# Altium schematic sheet driver be main.SchDoc
size A
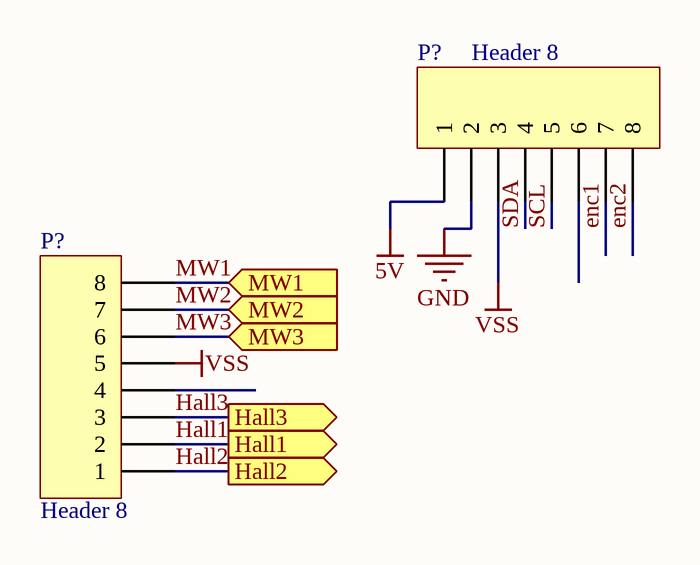
[diagram p0: driver be main.SchDoc]

## Parts
(Parts that share a designator on the sheet are numbered #1, #2 ... from top to bottom, then left to right.)
P?#1  Header 8  [HDR1X8]
P?#2  Header 8  [HDR1X8]

## Ports
Hall1 (out), Hall2 (out), Hall3 (out), MW1 (in), MW2 (in), MW3 (in)

## Nets
5V: P?#1.1
GND: P?#1.2
VSS: P?#1.3 P?#2.5
enc1: P?#1.7
enc2: P?#1.8
Hall1: P?#2.2 ; port Hall1
Hall2: P?#2.1 ; port Hall2
Hall3: P?#2.3 ; port Hall3
MW1: P?#2.8 ; port MW1
MW2: P?#2.7 ; port MW2
MW3: P?#2.6 ; port MW3
SCL: P?#1.5
SDA: P?#1.4

Not connected (* = marked no-connect by the designer): P?#1 6; P?#2 4

## Library data of the parts
P?#1 P?#2 = Header 8: Header, 8-Pin; LatestRevisionDate: 17-Jul-2002; LatestRevisionNote: Re-released for DXP Platform.; Publisher: Altium Limited